# EasyEDA schematic SCH_IOT-SMART-IRRIGATION-SYSTEM_2025-08-11.json
TITLE: Sheet_1; REV: 1.0; Date: 2025-08-11; Sheet: 1/1; Drawn By: rwotngeyobrian7; Company: Your Company
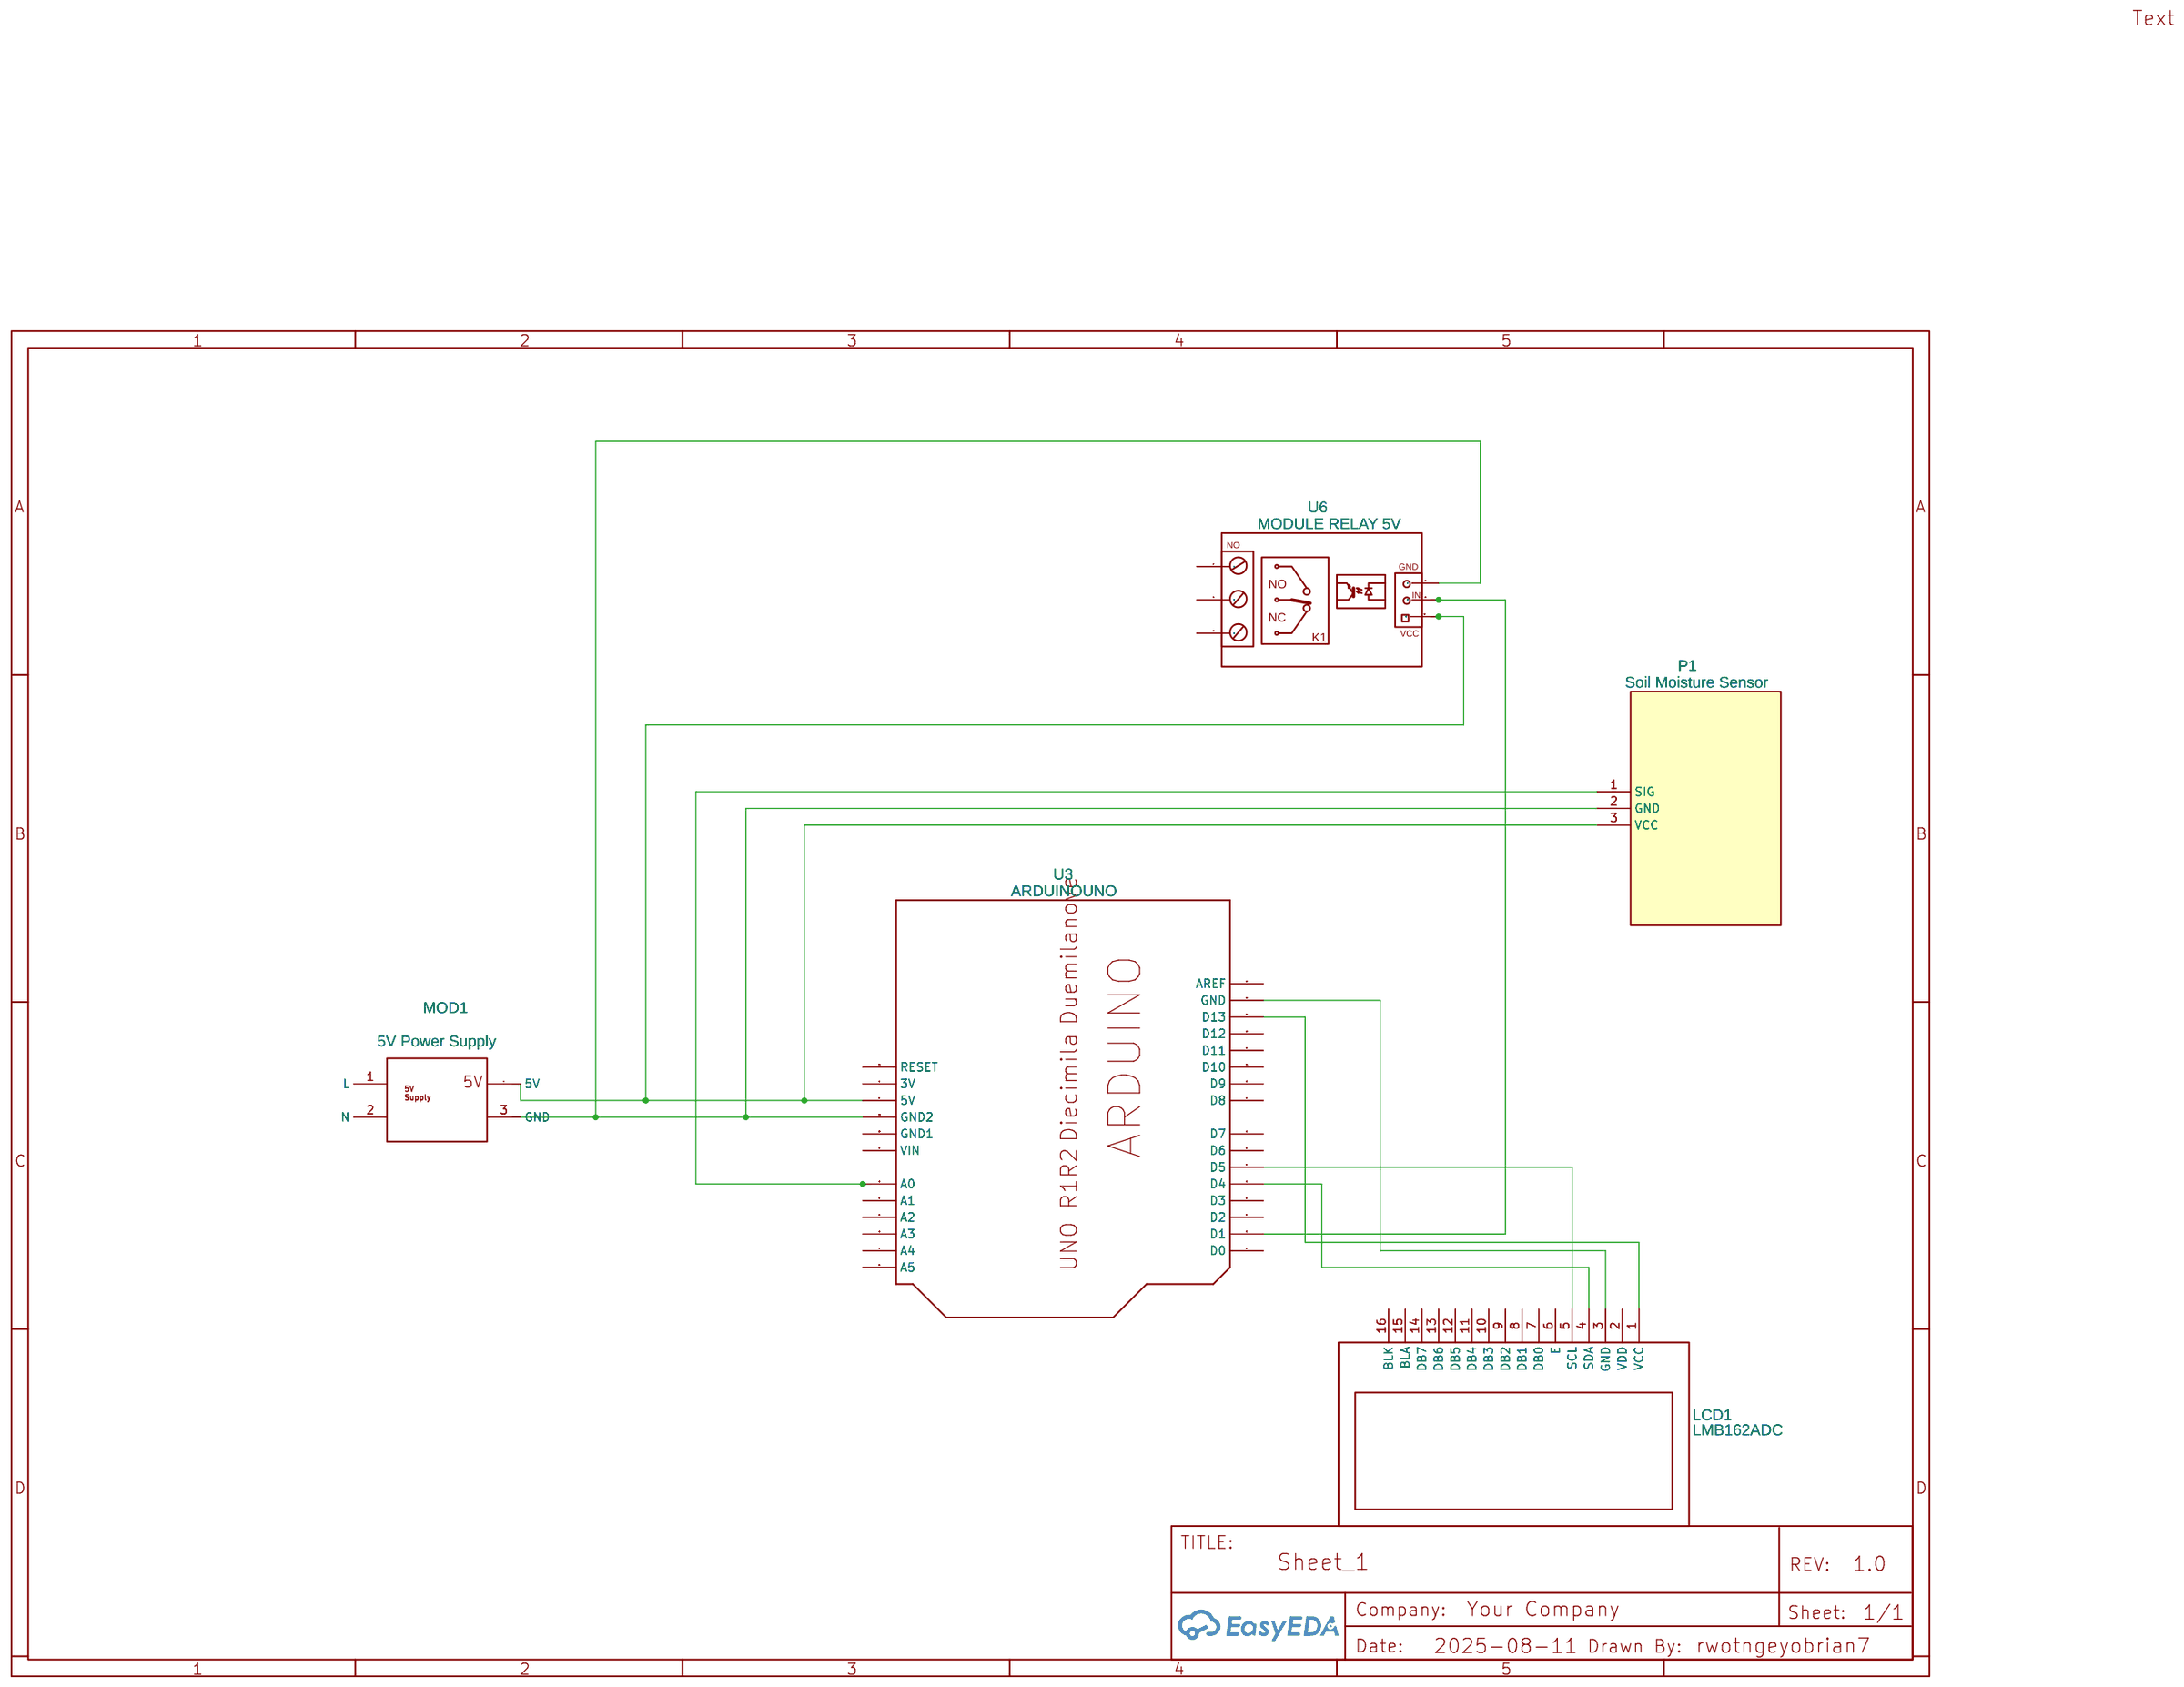
[diagram p0: schematic sheet]

## Parts
LCD1  LMB162ADC  [LCD1602]
MOD1  5V Power Supply  [5V POWER SUPPLY]
P1  Soil Moisture Sensor  [SOIL MOISTURE SENSOR]
U3  ARDUINOUNO  [ARDUINO]
U6  MODULE RELAY 5V  [RELAY MODULE 1 RELAYS]

## Library data of the parts
LCD1 = LMB162ADC: Supplier: LCSC; Manufacturer: TOPWAY; Supplier Part: C9741
MOD1 = 5V Power Supply: Contributor: inologic
P1 = Soil Moisture Sensor: sourceId: i6oizRL3l; Supplier Part: 12587; Supplier: SparkFun
U3 = ARDUINOUNO: Arduino DiecimilaDuemilanove; Contributor: Adafruit
U6 = MODULE RELAY 5V: Manufacturer Part: 1-Channel 5V Relay Module w/ Opto-isolator; Supplier Part: SKU: 223429; link: http://www.volumerate.com/product/1-channel-5v-relay-module-w-opto-isolator-red-blue-223429; Contributor: Ahmad Aidit

## Nets
Net-(LCD1-1): LCD1.1(VCC) U3.D13
Net-(LCD1-3): LCD1.3(GND) U3.GND
Net-(LCD1-4): LCD1.4(SDA) U3.D4
Net-(LCD1-5): LCD1.5(SCL) U3.D5
Net-(P1-1): P1.1(SIG) U3.A0
Net-(P1-2): P1.2(GND) U3.GND2 U6.14
Net-(P1-3): P1.3(VCC) U3.5V U6.13
Net-(U3-D1): U3.D1 U6.15

Not connected (* = marked no-connect by the designer): LCD1 2(VDD) 6(E) 7(DB0) 8(DB1) 9(DB2) 10(DB3) 11(DB4) 12(DB5) 13(DB6) 14(DB7) 15(BLA) 16(BLK); MOD1 1(L) 2(N) 3(GND) 4(5V); U3 3V A1 A2 A3 A4 A5 AREF D0 D2 D3 D6 D7 D8 D9 D10 D11 D12 GND1 RESET VIN; U6 1 2 3
